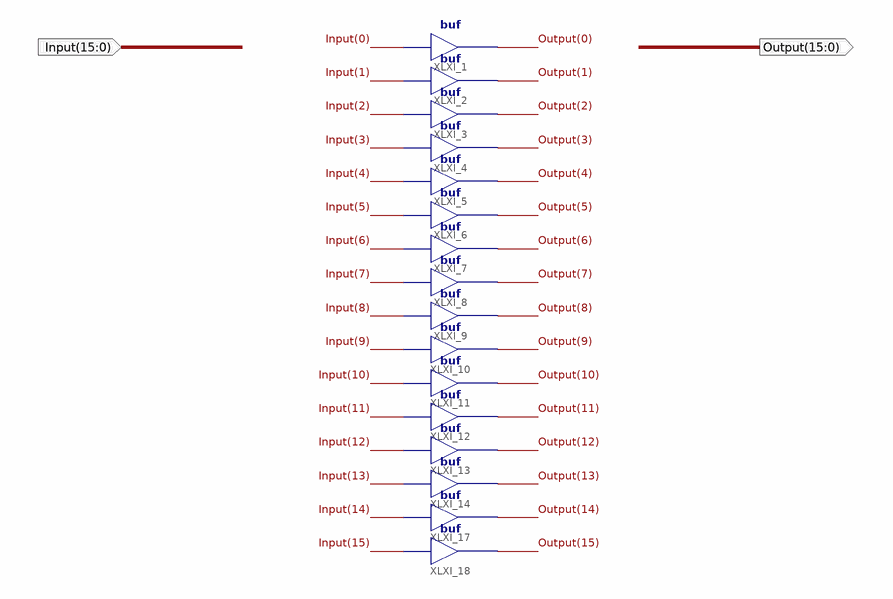
[diagram p0: schematic sheet 1]
// Xilinx ISE schematic buf16b.sch (spartan3e) as structural Verilog: 16 symbols, 2 ports
module buf16b (
  input  [15:0] Input,
  output [15:0] Output
);

  buf XLXI_1 (Output[0], Input[0]);
  buf XLXI_2 (Output[1], Input[1]);
  buf XLXI_3 (Output[2], Input[2]);
  buf XLXI_4 (Output[3], Input[3]);
  buf XLXI_5 (Output[4], Input[4]);
  buf XLXI_6 (Output[5], Input[5]);
  buf XLXI_7 (Output[6], Input[6]);
  buf XLXI_8 (Output[7], Input[7]);
  buf XLXI_9 (Output[8], Input[8]);
  buf XLXI_10 (Output[9], Input[9]);
  buf XLXI_11 (Output[10], Input[10]);
  buf XLXI_12 (Output[11], Input[11]);
  buf XLXI_13 (Output[12], Input[12]);
  buf XLXI_14 (Output[13], Input[13]);
  buf XLXI_17 (Output[14], Input[14]);
  buf XLXI_18 (Output[15], Input[15]);
endmodule
